# EAGLE design bristol_longshot (EAGLE 7.3.0)
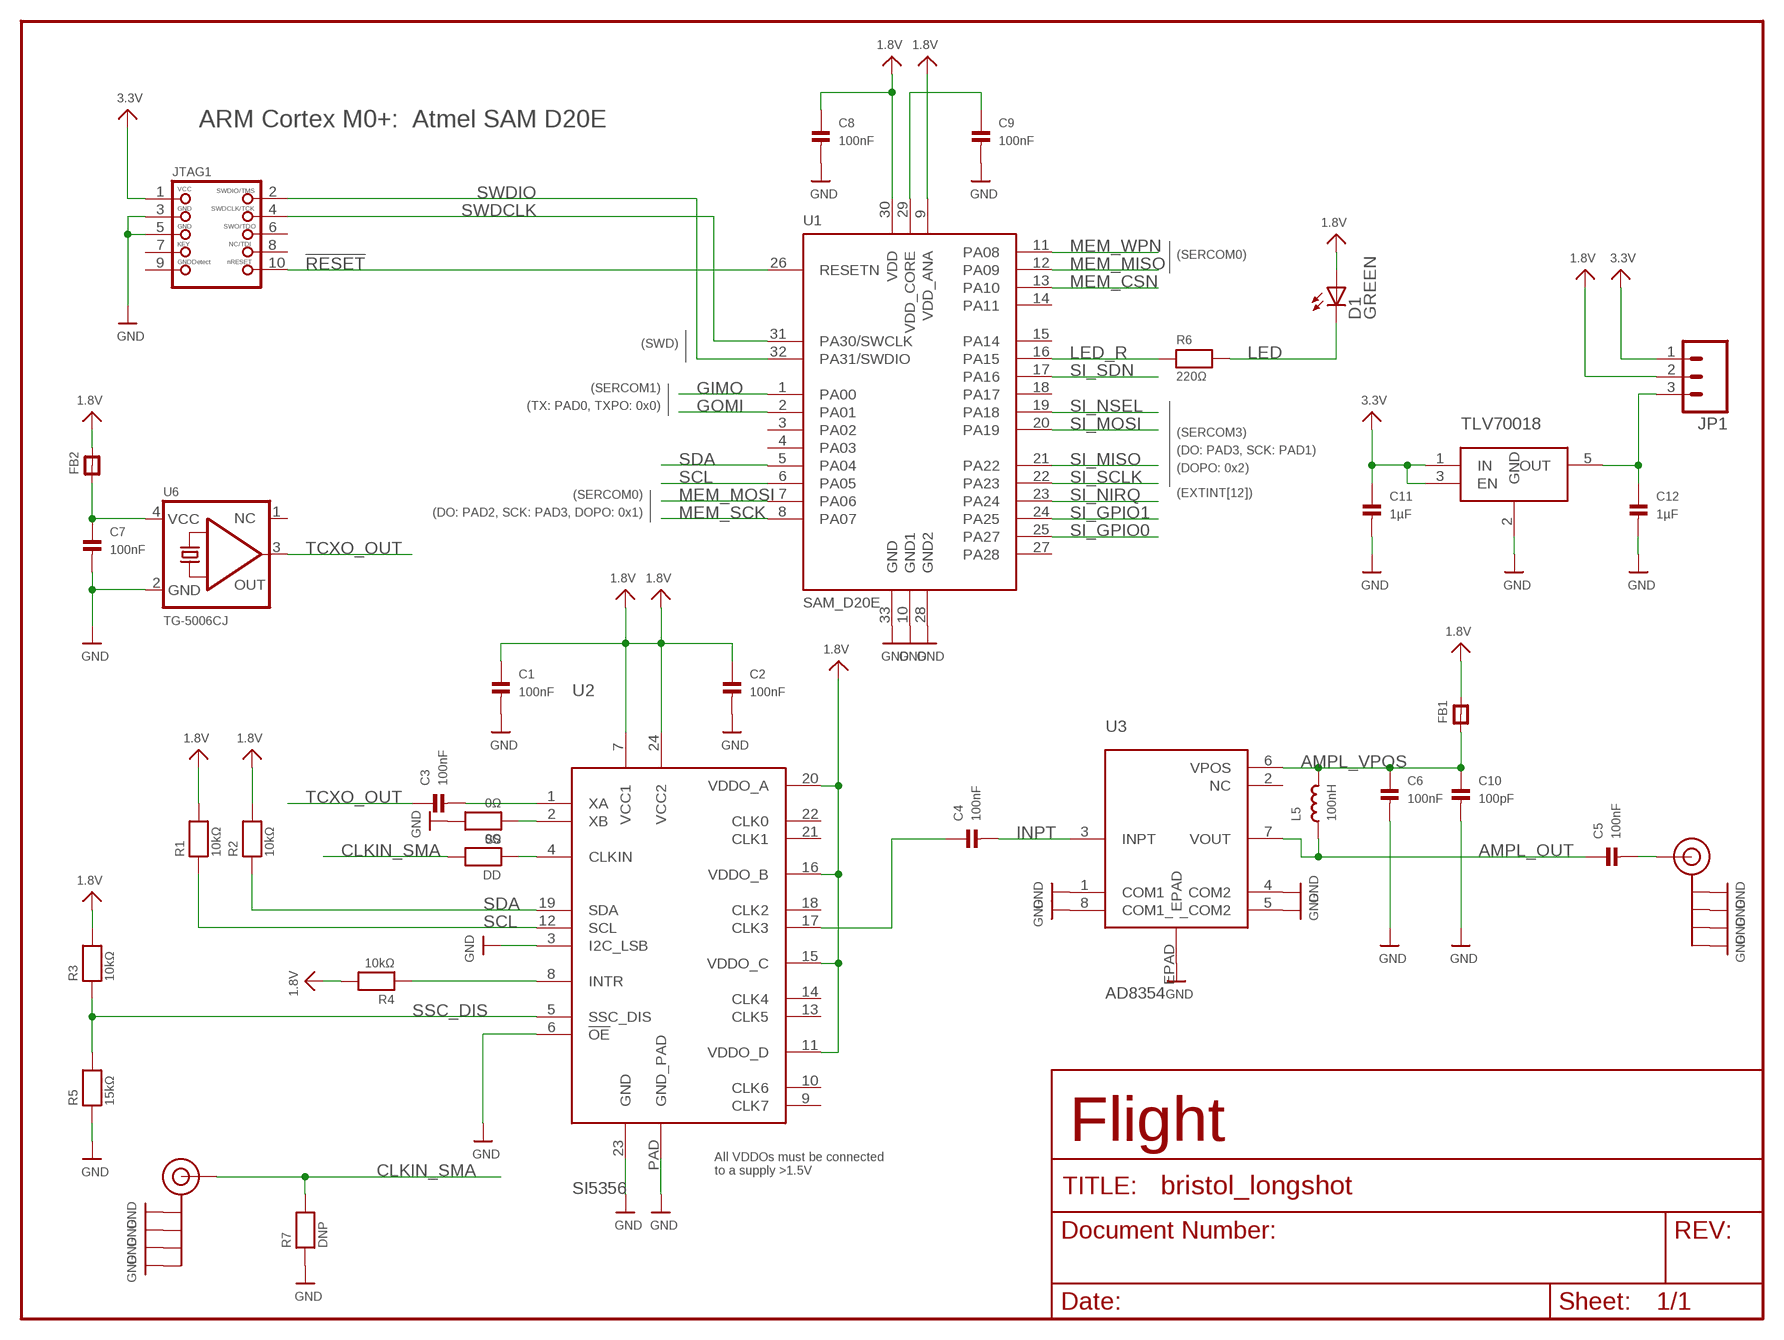
[diagram p0: schematic, sheet 1]

## Parts
C1  100nF  CAP_CERAMIC_0402  [_0402]
C2  100nF  CAP_CERAMIC_0402  [_0402]
C3  100nF  CAP_CERAMIC_0402  [_0402]
C4  100nF  CAP_CERAMIC_0402  [_0402]
C5  100nF  CAP_CERAMIC_0402  [_0402]
C6  100nF  CAP_CERAMIC_0402  [_0402]
C7  100nF  CAP_CERAMIC_0402  [_0402]
C8  100nF  CAP_CERAMIC_0402  [_0402]
C9  100nF  CAP_CERAMIC_0402  [_0402]
C10  100pF  CAP_CERAMIC_0402  [_0402]
C11  1µF  CAP_CERAMIC_0402  [_0402]
C12  1µF  CAP_CERAMIC_0402  [_0402]
D1  GREEN  LEDCHIPLED_0603  [CHIPLED_0603]
DD  0Ω  RESISTOR_0402  [_0402]
FB1  FERRITE_0402  [_0402]
FB2  FERRITE_0402  [_0402]
J$1  SMA_EDGE  [SMA-EDGE]
J$2  SMA_EDGE  [SMA-EDGE]
JP1  M03LOCK  [1X03_LOCK]
JTAG1  JTAG-CORTEXM3SMT  [2X05_1.27MM_SMT]
L5  100nH  INDUCTOR_0402  [_0402]
R1  10kΩ  RESISTOR_0402  [_0402]
R2  10kΩ  RESISTOR_0402  [_0402]
R3  10kΩ  RESISTOR_0402  [_0402]
R4  10kΩ  RESISTOR_0402  [_0402]
R5  15kΩ  RESISTOR_0402  [_0402]
R6  220Ω  RESISTOR_0402  [_0402]
R7  DNP  RESISTOR_0402  [_0402]
SS  0Ω  RESISTOR_0402  [_0402]
U1  SAM_D20E  [QFN32_5MM]
U2  SI5356  [QFN24_4MM]
U3  AD8354  [LFCSP_VD_8]
U4  TLV70018DCK  TLV700DCK  [SC70-5L]
U6  TG-5006CJ  [TC-5006CJ]

## Nets
1.8V: C1.1 C2.1 C8.1 D1.A FB1.2 FB2.2 JP1.2 R1.2 R2.2 R3.2 R4.2 U1.9(VDD_ANA) U1.30(VDD) U2.7(VCC1) U2.11(VDDO_D) U2.15(VDDO_C) U2.16(VDDO_B) U2.20(VDDO_A) U2.24(VCC2)
3.3V: C11.1 JP1.1 JTAG1.1 U4.1(IN) U4.3(EN)
!RESET: JTAG1.10 U1.26(RESETN)
AMPL_OUT: C5.1 L5.1 U3.7(VOUT)
AMPL_VPOS: C6.1 C10.1 FB1.1 L5.2 U3.6(VPOS)
CLKIN: DD.1 U2.4(CLKIN)
CLKIN_SMA: DD.2 J$1.SIG(SIGNAL) R7.2
GIMO: U1.1(PA00)
GND: C1.2 C2.2 C6.2 C7.2 C8.2 C9.2 C10.2 C11.2 C12.2 J$1.GND@0(GND) J$1.GND@1(GND) J$1.GND@2(GND) J$1.GND@3(GND) J$2.GND@0(GND) J$2.GND@1(GND) J$2.GND@2(GND) J$2.GND@3(GND) JTAG1.3 JTAG1.5 R5.1 R7.1 SS.2 U1.10(GND1) U1.28(GND2) U1.33(GND) U2.3(I2C_LSB) U2.6(!OE) U2.23(GND) U2.PAD(GND_PAD) U3.1(COM1) U3.4(COM2) U3.5(_COM2) U3.8(COM1_) U3.EPAD U4.2(GND) U6.2(GND)
GOMI: U1.2(PA01)
HF: C5.2 J$2.SIG(SIGNAL)
HF_CLK: C4.1 U2.17(CLK3)
INPT: C4.2 U3.3(INPT)
INTR: R4.1 U2.8(INTR)
LED: D1.C R6.2
LED_R: R6.1 U1.16(PA15)
MEM_CSN: U1.13(PA10)
MEM_MISO: U1.12(PA09)
MEM_MOSI: U1.7(PA06)
MEM_SCK: U1.8(PA07)
MEM_WPN: U1.11(PA08)
N$1: C12.1 JP1.3 U4.5(OUT)
SCL: R1.1 U1.6(PA05) U2.12(SCL)
SDA: R2.1 U1.5(PA04) U2.19(SDA)
SI_GPIO0: U1.25(PA27)
SI_GPIO1: U1.24(PA25)
SI_MISO: U1.21(PA22)
SI_MOSI: U1.20(PA19)
SI_NIRQ: U1.23(PA24)
SI_NSEL: U1.19(PA18)
SI_SCLK: U1.22(PA23)
SI_SDN: U1.17(PA16)
SSC_DIS: R3.1 R5.2 U2.5(SSC_DIS)
SWDCLK: JTAG1.4 U1.31(PA30/SWCLK)
SWDIO: JTAG1.2 U1.32(PA31/SWDIO)
TCXO_OUT: C3.1 U6.3(OUT)
TCXO_VDD: C7.1 FB2.1 U6.4(VCC)
VDD_CORE: C9.1 U1.29(VDD_CORE)
XA: C3.2 U2.1(XA)
XB: SS.1 U2.2(XB)
Unconnected: JTAG1.6 JTAG1.7 JTAG1.8 JTAG1.9 U1.3(PA02) U1.4(PA03) U1.14(PA11) U1.15(PA14) U1.18(PA17) U1.27(PA28) U2.9(CLK7) U2.10(CLK6) U2.13(CLK5) U2.14(CLK4) U2.18(CLK2) U2.21(CLK1) U2.22(CLK0) U3.2(NC) U6.1(NC)

## Notes on the sheet
- ARM Cortex M0+:  Atmel SAM D20E
- (SERCOM0)
- (SWD)
- (SERCOM1)
- (TX: PAD0, TXPO: 0x0)
- TLV70018
- (SERCOM3)
- (DO: PAD3, SCK: PAD1)
- (DOPO: 0x2)
- (SERCOM0) | (EXTINT[12])
- (DO: PAD2, SCK: PAD3, DOPO: 0x1)
- Flight
- All VDDOs must be connected
  to a supply >1.5V

## Library data of the parts
C1-C12 = microbuilder_v3:CAP_CERAMIC: Ceramic Capacitors 0402 - 0402 Surface Mount Capacitors 16pF 50V 5% [Digikey: 445-4899-2-ND] 18pF 50V 5% [Digikey: 490-1281-2-ND] 22pF 50V 5% [Digikey: 490-1283-2-ND] 68pF 50V 5% [Digikey: 490-1289-2-ND] 0.1uF 10V 10% [Digikey: 490-1318-2-ND] 1.0uF 6.3V 10% [Digikey: 490-1320-2-ND] 0603 - 0603 Surface Mount Capacitors 16 pF 50V 5% [Digikey: 445-5051-2-ND] 22 pF 50V [Digikey: PCC220ACVTR-ND] 33 pF 50V 5% [Digikey: 490-1415-1-ND] 56pF 50V 5% [Digikey: 490-1421-1-ND] 220pF 50V 5% [Digikey: 445-1285-1-ND] 680 pF 50V 2200 pF 50V 5% C0G [Digikey: 445-1297-1-ND] 5600 pF 100V 5% X7R [Digikey: 478-3711-1-ND] 0.1 µF 25V 10% [Digikey: PCC2277TR-ND] 0.22 µF 16V 10% X7R [Digikey: 445-1318-1-ND] 1.0 µF 25V 10% [Digikey: 445-5146-2-ND] 0603 - RF Specific 3pF 250V +/-0.1pF RF [Digikey: 712-1347-1-ND] 18 pF 250V 5% [Digikey: 478-3505-1-ND or 712-1322-1-ND] 56 pF 250V 5% C0G RF [Digikey: 490-4867-1-ND] 68 pF 250V RF [Digikey: 490-4868-1-ND] 0805 - 0805 Surface Mount Capacitors 220 pF 250V 2% RF Ceramic Capacitor [Digikey: 712-1398-1-ND] 1000 pF 50V 2% NP0 Ceramic Capacitor [Digikey: 478-3760-1-ND] 0.1 µF 25V 10% Ceramic Capacitor [Digikey: PCC1828TR-ND] 1.0 µF 16V 10% Ceramic Capacitor[Digikey: 490-1691-2-ND] 10.0 µF 10V 10% Ceramic Capacitor[Digikey: 709-1228-1-ND] 10.0 uF 16V 10% Ceramic Capacitor [Digikey: 478-5165-2-ND] 47 uF 6.3V 20% Ceramic Capacitor [Digikey: 587-1779-1-ND or 399-5506-1-ND] 1206 - 1206 Surface Mount Capacitors 47uF 10V 20% Ceramic Capacitor [Digikey: 490-5528-1-ND or 399-5508-1-ND or 445-6010-1-ND] 100uF 6.3V -20%, +80% Y5V Ceramic Capacitor (Digikey: 490-4512-1-ND, Mouser: 81-GRM31CF50J107ZE1L)
D1 = led:LED: LED OSRAM: - CHIPLED LG R971, LG N971, LY N971, LG Q971, LY Q971, LO R971, LY R971 LH N974, LH R974 LS Q976, LO Q976, LY Q976 LO Q996 - Hyper CHIPLED LW Q18S LB Q993, LB Q99A, LB R99A - SideLED LS A670, LO A670, LY A670, LG A670, LP A670 LB A673, LV A673, LT A673, LW A673 LH A674 LY A675 LS A676, LA A676, LO A676, LY A676, LW A676 LS A679, LY A679, LG A679 - Hyper Micro SIDELED® LS Y876, LA Y876, LO Y876, LY Y876 LT Y87S - SmartLED LW L88C, LW L88S LB L89C, LB L89S, LG L890 LS L89K, LO L89K, LY L89K LS L896, LA L896, LO L896, LY L896 - TOPLED LS T670, LO T670, LY T670, LG T670, LP T670 LSG T670, LSP T670, LSY T670, LOP T670, LYG T670 LG T671, LOG T671, LSG T671 LB T673, LV T673, LT T673, LW T673 LH T674 LS T676, LA T676, LO T676, LY T676, LB T676, LH T676, LSB T676, LW T676 LB T67C, LV T67C, LT T67C, LS T67K, LO T67K, LY T67K, LW E67C LS E67B, LA E67B, LO E67B, LY E67B, LB E67C, LV E67C, LT E67C LW T67C LS T679, LY T679, LG T679 LS T770, LO T770, LY T770, LG T770, LP T770 LB T773, LV T773, LT T773, LW T773 LH T774 LS E675, LA E675, LY E675, LS T675 LS T776, LA T776, LO T776, LY T776, LB T776 LHGB T686 LT T68C, LB T68C - Hyper Mini TOPLED® LB M676 - Mini TOPLED Santana® LG M470 LS M47K, LO M47K, LY M47K Source: http://www.osram.convergy.de LUXEON: - LUMILED® LXK2-PW12-R00, LXK2-PW12-S00, LXK2-PW14-U00, LXK2-PW14-V00 LXK2-PM12-R00, LXK2-PM12-S00, LXK2-PM14-U00 LXK2-PE12-Q00, LXK2-PE12-R00, LXK2-PE12-S00, LXK2-PE14-T00, LXK2-PE14-U00 LXK2-PB12-K00, LXK2-PB12-L00, LXK2-PB12-M00, LXK2-PB14-N00, LXK2-PB14-P00, LXK2-PB14-Q00 LXK2-PR12-L00, LXK2-PR12-M00, LXK2-PR14-Q00, LXK2-PR14-R00 LXK2-PD12-Q00, LXK2-PD12-R00, LXK2-PD12-S00 LXK2-PH12-R00, LXK2-PH12-S00 LXK2-PL12-P00, LXK2-PL12-Q00, LXK2-PL12-R00 Source: www.luxeon.com KINGBRIGHT: KA-3528ASYC Source: www.kingbright.com
DD R1-R7 SS = microbuilder_v3:RESISTOR: Resistors 0402 - 0402 Surface Mount Package 22 Ohm 1% 1/16W [Digikey: 311-22.0LRTR-ND] 33 Ohm 5% 1/16W 1.0K 5% 1/16W 1.5K 5% 1/16W 2.0K 1% 1/16W 10.0K 1% 1/16W [Digikey: 311-10.0KLRTR-ND] 10.0K 5% 1/16W [Digikey: RMCF0402JT10K0TR-ND] 12.1K 1% 1/16W [Digikey: 311-22.0LRTR-ND] 100.0K 5% 1/16W 0603 - 0603 Surface Mount Package 0 Ohm 1/10 Watt 1% Resistor 15 Ohm 1/10 Watt 1% Resistor 33 Ohm 1/10 Watt 1% Resistor 49.9 Ohm 1/10 Watt 1% Resistor 100 Ohm 1/10 Watt 1% Resistor 150 Ohm 1/10 Watt 1% Resistor 240 Ohm 1/10 Watt 1% Resistor 390 Ohm 1/10 Watt 1% Resistor 560 Ohm 1/10 Watt 1% Resistor 680 Ohm 1/10 Watt 1% Resistor 750 Ohm 1/10 Watt 1% Resistor 1.0K Ohm 1/10 Watt 1% Resistor 1.5K Ohm 1/10 Watt 1% Resistor 2.0K Ohm 1/10 Watt 1% Resistor 2.2K Ohm 1/10 Watt 1% Resistor 3.3K Ohm 1/10 Watt 1% Resistor 4.7K Ohm 1/10 Watt 1% Resistor 10.0K Ohm 1/10 Watt 1% Resistor 12.0K Ohm 1/10 Watt 1% Resistor 12.1K Ohm 1/10 Watt 1% Resistor 20.0K Ohm 1/10 Watt 1% Resistor 33.0K Ohm 1/10 Watt 1% Resistor 100.0K Ohm 1/10 Watt 1% Resistor 0805 - 0805 Surface Mount Package 0 Ohm 1/8 Watt 1% Resistor 33 Ohm 1/8 Watt 1% Resistor 100 Ohm 1/8 Watt 1% Resistor 150 Ohm 1/8 Watt 1% Resistor 200 Ohm 1/8 Watt 1% Resistor 240 Ohm 1/8 Watt 1% Resistor 330 Ohm 1/8 Watt 1% Resistor 390 Ohm 1/8 Watt 1% Resistor 470 Ohm 1/8 Watt 1% Resistor 1.0K Ohm 1/8 Watt 1% Resistor 1.5K Ohm 1/8 Watt 1% Resistor 2.0K Ohm 1/8 Watt 1% Resistor 4.7K Ohm 1/8 Watt 1% Resistor 5.1K Ohm 1/8 Watt 1% Resistor 5.6K Ohm 1/8 Watt 1% Resistor 10.0K Ohm 1/8 Watt 1% Resistor 22.0K Ohm 1/8 Watt 1% Resistor 33.0K Ohm 1/8 Watt 1% Resistor 100K Ohm 1/8 Watt 1% Resistor 1206 - 1206 Surface Mount Package 2012 - 2010 Surface Mount Package 0.11 Ohm 1/2 Watt 1% Resistor - Digikey: RHM.11UCT-ND
FB1 FB2 = microbuilder_v3:FERRITE: Ferrite Bead 0603 MMZ1608B121C - 120 Ohm @ 100MHz, 600mA, 0.15 Ohm DC Resistance - Digikey: 445-2164-1-ND BK1608HW121-T - 120 Ohm, 600mA Ferrite Chip - Digikey: 587-1876-2-ND 0805 HZ0805B272R-10 - 2.7K Ohm @ 100MHz, 200mA, 0.8 Ohm DC Resistance - Digikey: 240-2504-1-ND (see also Murata BLM21BD272SN1L) MMZ2012Y152B - 1.5K Ohm @ 100MHz, 500mA, 0.4 Ohm DC Resistance - Digikey: 445-1560-1-ND - Mainly for high frequency (80-400MHz) MMZ2012R102A - 1K Ohm @ 100MHz, 500mA, 0.3 Ohm DC Resistance - Digikey: 445-1555-2-ND - More general purpose (10-200MHz)
J$1 J$2 = SparkFun:SMA_EDGE: SMA Antenna Connector End launch SMA connector. The paste layer has been removed so that the connector can be hand soldered onto the board after reflow.
JP1 = SparkFun:M03: Header 3 Standard 3-pin 0.1" header. Use with straight break away headers (SKU : PRT-00116), right angle break away headers (PRT-00553), swiss pins (PRT-00743), machine pins (PRT-00117), and female headers (PRT-00115). Molex polarized connector foot print use with SKU : PRT-08232 with associated crimp pins and housings.
JTAG1 = microbuilder_v3:JTAG-CORTEXM3: Serial Wire (SW-DP) Connector This standard 0.05" 10-pin connector is for use with the Cortex M0/M3's native SWD (serial wire debugger) interface (SW-DP). Some boards support a 20-pin combined JTAG+SWD connector (SWJ-DP), such as the LPC1700 family, but many smaller devices only work with SWD which typically use the smaller 10-pin SW-DP connecter (the LPC1300 family, for example, only supports SWD). 2x05 1.27mm/0.05" Connector: This is the standard SMT connector defined by ARM for all Cortex devices, and should be used in most situations and for forward-compatibility since any new devices coming to market will likely use this connector. MOLEX 10 Pin 0.1" Connector: This 0.1" 10 pin connector has the same pin layout as the standard 0.05" connector, but is easier to work with if you are using standard jumper wires or custom cables to connect your SWD hardware. MOLEX 20 Pin 0.1" Connector: This 0.1" 20 pin connector is the same model used for ARM7/ARM9 JTAG debuggers, but is connected to match the pins on the Segger J-Link for ARM (which supports both JTAG and SWD debugging). See the following document from ARM for more information on Cortex M3 Debug Connectors: http://infocenter.arm.com/help/topic/com.arm.doc.faqs/attached/13634/cortex_debug_connectors.pdf And the following page for an overview with images of the different connector types: http://www.keil.com/peripherals/coresight/connectors.asp
L5 = microbuilder_v3:INDUCTOR: Inductors 0603: 10nH Ceramic Inductor - microwire antenna/RF (Digikey: 712-1434-2-ND) 0805: 560nH Ceramic Inductor - RF (Digikey: 553-1047-1-ND) 270nH Ceramic Inductor - Q = 40@250MHz, +-5%, 1 Ohm DC Resistance (Digikey: 535-10506-2-ND) 1007 (2518 Metric) SMT: 10µH 10% 250mOhm 820mA 1007 Inductor (Digikey: 587-2189-1-ND) 22µH 10% 500mOhm 580mA 1007 Inductor (Digikey: 587-2190-1-ND) 47µH 10% 950mOhm 420mA 1007 Inductor (Digikey: 587-2191-1-ND) 47µH 5% 100mOhm 1A 1008 Inductor (Digikey: 732-1816-1-ND) 5.0x5.0mm (Taiyo Yuden NR5040 Series) 6.8µH 20% 2.3A 64mOhm Inductor (Digikey: 587-2374-2-ND) 5.0x5.0mm (TDK VLC5045 Series) 4.7µH 20% 3.3A 34mOhm Inductor (Digikey: 445-6526-1-ND) 6.8µH 20% 2.7A 46mOhm Inductor (Digikey: 445-6527-1-ND) 6.0x6.0mm (TDK VLC6045 Series) 4.7µH 20% 3.8A 27mOhm Inductor (Digikey: 445-6538-2-ND) 6.8µH 20% 3A 41mOhm Inductor (Digikey: 445-6540-1-ND) 6.2µH 30% 2.2A 45mOhm Inductor (Digikey: SRR5028-6R2YCT-ND) - Not TDK VLC6045 but footprint should match 6.0x6.0mm (TDK SLF6045 Series) 6.8uH 30% 2A 33mOhm Inductor (Digikey: 445-4572-1-ND, Mouser: 810-SLF645T6R8N2R0PF)
U1 = fbri:SAM_D20E
U2 = si5356:SI5356
U3 = fbri:AD8354
U4 = tlv700:TLV700
U6 = fbri:TG-5006CJ

## Board
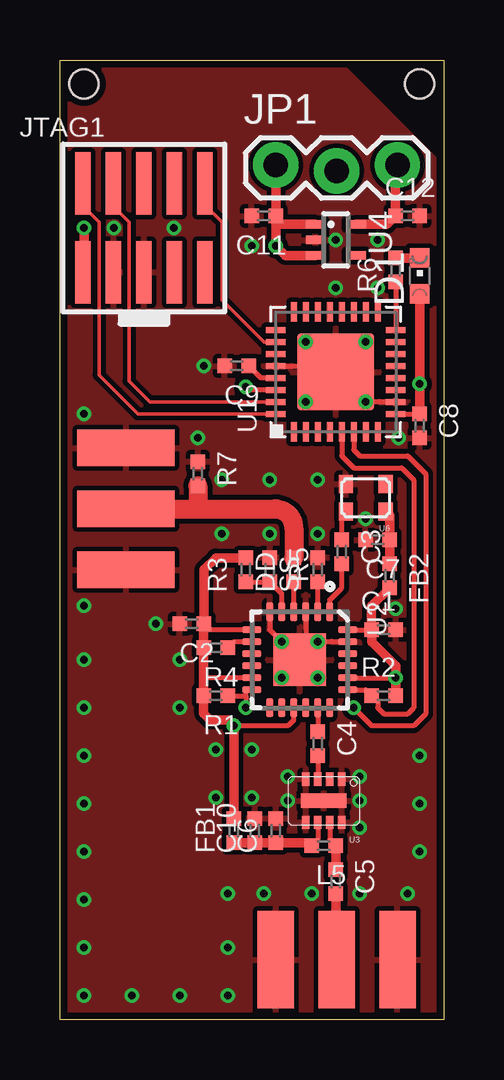
[diagram p1: board, top side]
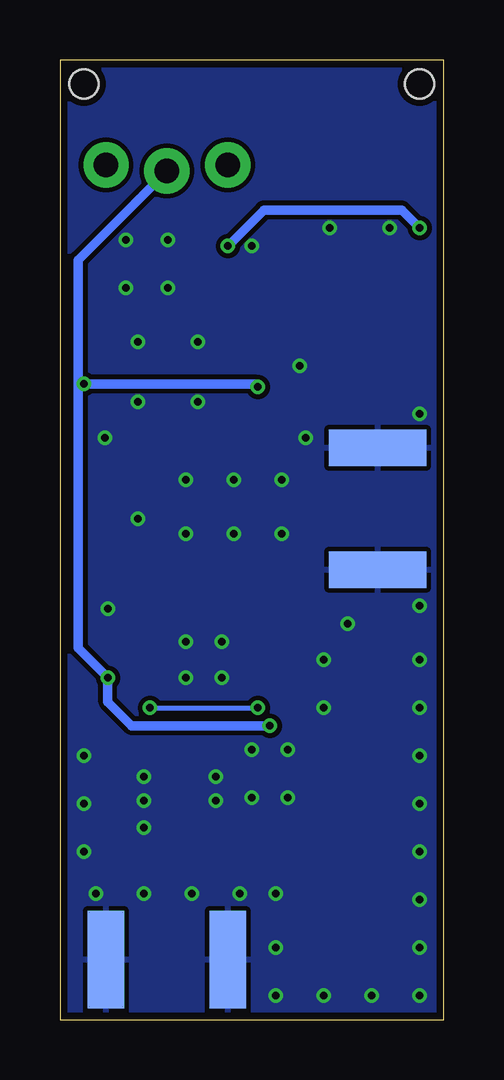
[diagram p2: board, bottom side, seen from below]

Size 16 x 40 mm. Coordinates in mm from the lower left corner, seen from the top.
Outline: 0,0 0,40 16,40 16,0 0,0
Copper layers (1*16): Top 0.035mm / dielectric 1.5mm / Bottom 0.035mm
Design rules "PCB-POOL Standard *": minimum track width 0.15mm, minimum drill 0.3mm, track to track 0.15mm, track to pad 0.15mm, pad to pad 0.15mm, via to via 0.15mm, smd to smd 0.15mm, copper to edge 0.3mm, drill to drill 0.2mm, minimum pad ring 0.2mm, minimum via ring 0.15mm, stop-mask expansion 0.075mm, vias tented up to drill 0.3mm, thermal gap 0.2mm
Holes 1.2 mm at 1,39 15,39

### Footprints (pad centres in the part's own frame; a part is rotated, then mirrored left to right if it is on the bottom)
_0402 = smd 0.6 x 0.6: 1 -0.508,0; 2 0.508,0
CHIPLED_0603 = smd 0.8 x 0.8: A 0,-0.75; C 0,0.75
SMA-EDGE = smd 1.524 x 4.064: GND@0 0,0; GND@1 5.08,0; SIG 2.54,0 | smd 1.524 x 4.064 bottom: GND@2 0,0; GND@3 5.08,0
1X03_LOCK = drill 1.016 pad 1.88: 1 0,0.127; 2 2.54,-0.127; 3 5.08,0.127
2X05_1.27MM_SMT = smd 0.65 x 2.6: 1 -2.54,-1.85; 2 -2.54,1.85; 3 -1.27,-1.85; 4 -1.27,1.85; 5 0,-1.85; 6 0,1.85; 7 1.27,-1.85; 8 1.27,1.85; 9 2.54,-1.85; 10 2.54,1.85
QFN32_5MM = smd 0.8 x 0.25: 1 -2.5,1.75; 2 -2.5,1.25; 3 -2.5,0.75; 4 -2.5,0.25; 5 -2.5,-0.25; 6 -2.5,-0.75; 7 -2.5,-1.25; 8 -2.5,-1.75; 17 2.5,-1.75; 18 2.5,-1.25; 19 2.5,-0.75; 20 2.5,-0.25; 21 2.5,0.25; 22 2.5,0.75; 23 2.5,1.25; 24 2.5,1.75 | smd 0.25 x 0.8: 9 -1.75,-2.5; 10 -1.25,-2.5; 11 -0.75,-2.5; 12 -0.25,-2.5; 13 0.25,-2.5; 14 0.75,-2.5; 15 1.25,-2.5; 16 1.75,-2.5; 25 1.75,2.5; 26 1.25,2.5; 27 0.75,2.5; 28 0.25,2.5; 29 -0.25,2.5; 30 -0.75,2.5; 31 -1.25,2.5; 32 -1.75,2.5 | smd 3.2 x 3.2: 33 0,0
QFN24_4MM = smd 0.8 x 0.28: 1 -2,1.25; 2 -2,0.75; 3 -2,0.25; 4 -2,-0.25; 5 -2,-0.75; 6 -2,-1.25; 13 2,-1.25; 14 2,-0.75; 15 2,-0.25; 16 2,0.25; 17 2,0.75; 18 2,1.25 | smd 0.28 x 0.8: 7 -1.25,-2; 8 -0.75,-2; 9 -0.25,-2; 10 0.25,-2; 11 0.75,-2; 12 1.25,-2; 19 1.25,2; 20 0.75,2; 21 0.25,2; 22 -0.25,2; 23 -0.75,2; 24 -1.25,2 | smd 2.2 x 2.2: PAD 0,0
LFCSP_VD_8 = smd 0.3 x 0.55: 1 -0.75,-0.9; 2 -0.25,-0.9; 3 0.25,-0.9; 4 0.75,-0.9; 5 0.75,0.9; 6 0.25,0.9; 7 -0.25,0.9; 8 -0.75,0.9 | smd 1.89 x 0.6: EPAD 0,0
SC70-5L = smd 0.35 x 0.8: 1 -0.65,-0.85; 2 0,-0.85; 3 0.65,-0.85; 4 0.65,0.85; 5 -0.65,0.85
TC-5006CJ = smd 0.6 x 0.75: 1 -0.825,-0.565; 2 0.825,-0.565; 3 0.825,0.565; 4 -0.825,0.565

### Placement (x,y rotation side)
C1  13.5,16.25 0 top
C2  5.5,16.5 180 top
C3  11.75,19.5 270 top
C4  10.75,11.5 270 top
C5  11.5,5.75 270 top
C6  9,7.88 90 top
C7  13.25,20 180 top
C8  15,24.75 270 top
C9  7.38,27.25 180 top
C10  8.12,7.88 90 top
C11  8.5,33.5 180 top
C12  14.5,33.5 0 top
D1  15,31 0 top
DD  9.75,18.75 90 top
FB1  7.25,7.88 90 top
FB2  13.75,18.5 270 top
J$1  2.75,18.75 90 top
J$2  9,2.5 0 top
JP1  9,35.5 0 top
JTAG1  3.5,33 0 top
L5  11,7.25 180 top
R1  6.5,13.5 180 top
R2  13.5,13.5 0 top
R3  7.75,18.75 90 top
R4  6.5,15.5 180 top
R5  8.75,18.75 270 top
R6  14,31.25 90 top
R7  5.75,22.75 270 top
SS  10.75,18.75 90 top
U1  11.5,27 90 top
U2  10,15 270 top
U3  11,9.12 180 top
U4  11.5,32.5 270 top
U6  12.75,21.75 180 top

### Tracks (layer width: path | path; a pad name or v marks a point on that pad's centre or on a via)
1.8V  (via drill 0.3)
  Top 0.2: U2.16 U2.15 9.75,12.5 9.5,12.25 v7.25,12.25 | U2.24 C1.1 | U2.7 6.01,16.25 C2.1 | U2.11 5.99,14.25 5.99,14.5 | U2.20 v14,14.25 | U1.9 C8.1 | U1.30 7.88,26.25 v7.75,26.38
  Top 0.4: FB2.2 12.99,17.23 C1.1 13,15.75 14.01,14.74 v14.01,14.25 | R3.2 6.5,19.25 6.01,18.76 C2.1 5.99,16.48 R4.2 5.99,14.5 R1.2 5.99,12.76 6.25,12.5 7,12.5 v7.25,12.25 FB1.2 | R2.2 v14.01,14.25 | D1.A v15,26.5 C8.1 | v14.01,14.25 v14,14.25
  Bottom 0.4: 15.25,26.5 15.25,15.5 v14,14.25 v14.01,14.24 14.01,13.25 13.01,12.25 v7.25,12.25 | JP1.2 15.25,31.66 15.25,26.5 | 15.25,26.5 v15,26.5 7.88,26.5 v7.75,26.38
3.3V  (via drill 0.3)
  Top 0.4: JP1.1 C11.1 | C11.1 9.01,33.15 U4.1 | C11.1 v9,32.25 9.4,31.85 U4.3 | v1,33 1,31.19 JTAG1.1
  Bottom 0.4: v1,33 1.75,33.75 7.5,33.75 v9,32.25
!RESET
  Top 0.15: JTAG1.10 6.04,33.96 6.75,33.25 6.75,30 8.5,28.25 U1.26
AMPL_OUT
  Top 0.2: U3.7 11.25,7.51 L5.1
  Top 0.4: C5.1 L5.1
AMPL_VPOS
  Top 0.2: U3.6 10.75,7.51 L5.2
  Top 0.4: FB1.1 C10.1 C6.1 10.38,7.37 L5.2
CLKIN
  Top 0.2: U2.4 DD.1
CLKIN_SMA
  Top 0.8: J$1.SIG 5.75,21.29 | 5.75,21.29 8.96,21.29 arc-90 9.75,20.5 DD.2 | R7.2 5.75,21.29
GND  (via drill 0.3)
  Top 0.2: U2.23 v10.75,15.75 10.25,15.75 | U2.3 10.25,15.75 | 10.25,15.75 10.25,15.25 U2.PAD | 10.75,27.25 11.25,27.25 U1.33 | U1.28 10.75,27.25 | 10.75,27.25 10.75,27.75 v10.25,28.25 | U2.6 8.75,16.25 v9.25,15.75 | U1.10 v12.75,25.75
  other vias: 10.75,14.25 9.25,14.25 10.75,20.25 10.25,25.75 12.75,28.25 8.75,20.25 14,17.12 9.5,9.12 12.5,9.12 9.5,10.12 12.5,10.12 12.5,8 10.5,5.25 12.5,5.25 14.5,5.25 8.5,5.25 1,25.25 1,17.25 4,16.5 1,15 1,13 1,11 1,9 1,7 1,5 1,3 3,1 5,1 7,1 15,11 15,9 15,7 1,1 6.75,20.25 6.75,22.5 8.75,22.5 5.75,24.25 7,3 7,5.25 8,9.25 8,11.25 6.5,11.25 6.5,9.25 5,15 5,13 11.5,32.5 8,32.25 13.25,32.5 13.25,30.5 11.5,30.5 2.25,33 4.75,33 14.12,24.25 6,27.25 12.75,20.88 10.75,22.5
  pour Top (isolate 0.2): 0,40 11.5,40 16,35.5 16,0 0,0
  pour Bottom (isolate 0.2): 0,40 16,40 16,0 0,0
HF
  Top 0.4: C5.2 11.5,2.54 J$2.SIG
HF_CLK
  Top 0.2: U2.17 C4.1
INPT
  Top 0.2: C4.2 U3.3
INTR
  Top 0.2: U2.8 7.26,15.75 R4.1
LED
  Top 0.4: D1.C R6.2
LED_R
  Top 0.2: R6.1 U1.16
N$1
  Top 0.4: JP1.3 13.99,35.54 C12.1 13.64,33.15 U4.5
SCL  (via drill 0.3)
  Top 0.2: R1.1 7.75,13.5 | 7.75,13.5 v7.75,13 | 7.75,13.5 7.75,13.75 U2.12 | U1.6 12.25,23.75 12.5,23.5 14.5,23.5 15.25,22.75 15.25,12.75 14.75,12.25 13,12.25 v12.25,13
  Bottom 0.2: v12.25,13 v7.75,13
SDA
  Top 0.2: U2.19 12.74,13.75 R2.1 13.25,13.25 13.25,13 13.5,12.75 14.5,12.75 14.75,13 14.75,22.5 14.25,23 12.25,23 11.75,23.5 U1.5
SSC_DIS
  Top 0.2: R3.1 R5.2 9.25,17.74 U2.5
SWDCLK
  Top 0.15: JTAG1.4 2.23,33.9 2.88,33.25 2.88,26.62 3.75,25.75 U1.31
SWDIO
  Top 0.15: JTAG1.2 0.96,33.91 1.62,33.25 1.62,26.88 3.25,25.25 U1.32
TCXO_OUT
  Top 0.2: C3.1 11.75,21.01 U6.3
TCXO_VDD
  Top 0.4: U6.4 13.76,21 C7.1 FB2.1
VDD_CORE
  Top 0.2: U1.29 8.38,26.75 C9.1
XA
  Top 0.2: U2.1 11.25,17.49 11.75,18 C3.2
XB
  Top 0.2: U2.2 SS.1

### Text on the board
tStop: UNIVERSITY | OF | BRISTOL | 3.3V | 1.8V | ARM-SWD | CLKIN | HF OUT
bStop: (C) Richard Meadows 2014